# EAGLE design HM_Nightfall-mini-2e_Encoder-PCB-L_v1 (EAGLE 9.6.2)
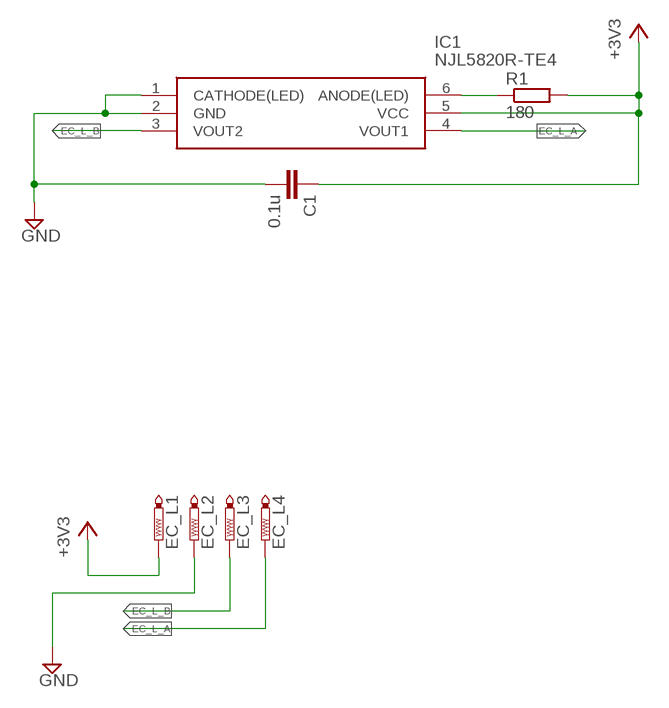
[diagram p0: schematic, sheet 1]

## Parts
C1  0.1u  C-EUC0402  [C0402]
EC_L1  PTR1TP06SQ  [TP06SQ]
EC_L2  PTR1TP06SQ  [TP06SQ]
EC_L3  PTR1TP06SQ  [TP06SQ]
EC_L4  PTR1TP06SQ  [TP06SQ]
IC1  NJL5820R-TE4  [NJL5820RTE4]
R1  180  R-EU_R0402  [R0402]

## Nets
+3V3: C1.1 EC_L1.TP IC1.5(VCC) R1.2
EC_L_A: EC_L4.TP IC1.4(VOUT1)
EC_L_B: EC_L3.TP IC1.3(VOUT2)
GND: C1.2 EC_L2.TP IC1.1(CATHODE(LED)) IC1.2(GND)
N$1: IC1.6(ANODE(LED)) R1.1

## Library data of the parts
C1 = rcl:C-EU: CAPACITOR, European symbol; SPICEPREFIX: C
EC_L1-EC_L4 = testpad:PTR1: TEST PIN
IC1 = NJL5820R-TE4:NJL5820R-TE4: Reflective Optical Sensor Mirror 6-SMD, No Lead Surface Mount 300 A 2.7V ~ 5.5V 6-SMD, No Lead Source: Datasheet <https://www.nisshinbo-microdevices.co.jp/en/pdf/datasheet/NJL5820R_E.pdf>; DESCRIPTION: Reflective Optical Sensor Mirror 6-SMD, No Lead Surface Mount 300 A 2.7V ~ 5.5V 6-SMD, No Lead; HEIGHT: 0.95mm; MANUFACTURER_NAME: Nisshinbo; MANUFACTURER_PART_NUMBER: NJL5820R-TE4; MOUSER_PART_NUMBER: 513-NJL5820R-TE4; MOUSER_PRICE-STOCK: https://www.mouser.co.uk/ProductDetail/Nisshinbo/NJL5820R-TE4?qs=rkhjVJ6%2F3EIV27NvruZpvA%3D%3D
R1 = rcl:R-EU_: RESISTOR, European symbol; SPICEPREFIX: R

## Net classes
1 power: width 0.152 mm
2 motor: width 0.152 mm

## Board
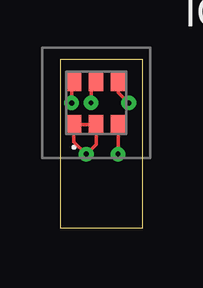
[diagram p1: board, top side]
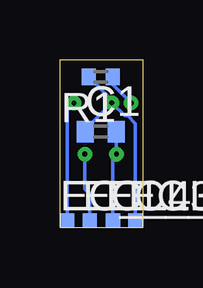
[diagram p2: board, bottom side, seen from below]

Size 3.45 x 7 mm. Coordinates in mm from the lower left corner, seen from the top.
Outline: 0,7 0,0 3.45,0 3.45,7 0,7
Copper layers (1*16): Top 0.035mm / dielectric 1.5mm / Bottom 0.035mm
Design rules "default *": minimum track width 6mil, minimum drill 0.2mm, track to track 4mil, track to pad 4mil, pad to pad 4mil, via to via 4mil, smd to smd 4mil, copper to edge 20mil, drill to drill 6mil, minimum pad ring 10mil, minimum via ring 8mil, stop-mask expansion 4mil, vias tented up to drill 0mil, thermal gap 10mil

### Footprints (pad centres in the part's own frame; a part is rotated, then mirrored left to right if it is on the bottom)
C0402 = smd 0.7 x 0.9: 1 -0.65,0; 2 0.65,0
TP06SQ = smd 0.6 x 0.6: TP 0,0
NJL5820RTE4 = smd 0.6 x 0.8: 1 -0.92,-0.9; 2 0,-0.9; 3 0.92,-0.9; 4 0.92,0.9; 5 0,0.9; 6 -0.92,0.9
R0402 = smd 0.6 x 0.7: 1 -0.5,0; 2 0.5,0

### Placement (x,y rotation side)
C1  1.75,4.01 0 bottom
EC_L1  0.31,0.3 0 bottom
EC_L2  1.25,0.3 0 bottom
EC_L3  2.21,0.3 0 bottom
EC_L4  3.15,0.3 0 bottom
IC1  1.5,5.2 0 top
R1  1.75,6.29 180 bottom

### Tracks (layer width: path | path; a pad name or v marks a point on that pad's centre or on a via)
+3V3  (via drill 0.2)
  Top 0.152: 1.63,6.1 IC1.5 1.29,5.89 v1.29,5.21
  Bottom 0.152: R1.2 1.29,5.33 v1.29,5.21 | C1.1 2.4,4.09 v1.29,5.21 | v1.29,5.21 0.76,4.67 0.64,4.67 0.31,4.34 EC_L1.TP
EC_L_A  (via drill 0.2)
  Top 0.152: 2.42,6.03 IC1.4 2.42,5.65 v2.86,5.2
  Bottom 0.152: EC_L4.TP 3.15,4.91 v2.86,5.2
EC_L_B  (via drill 0.2)
  Top 0.152: IC1.3 v2.42,3.07 v2.41,3.07
  Bottom 0.152: EC_L3.TP 2.21,1.42 2.41,1.62 v2.41,3.07
GND  (via drill 0.2)
  Top 0.152: IC1.1 IC1.2 1.5,3.48 v1.09,3.07 0.58,3.58 IC1.1
  Bottom 0.152: C1.2 1.1,3.08 | 1.1,3.08 v1.09,3.07 | EC_L2.TP 1.25,2.94 1.1,3.08
N$1  (via drill 0.2)
  Top 0.152: IC1.6 0.48,6.01 v0.48,5.2
  Bottom 0.152: v0.48,5.2 1.25,5.97 R1.1